# Altium schematic sheet Main.SchDoc
size A4
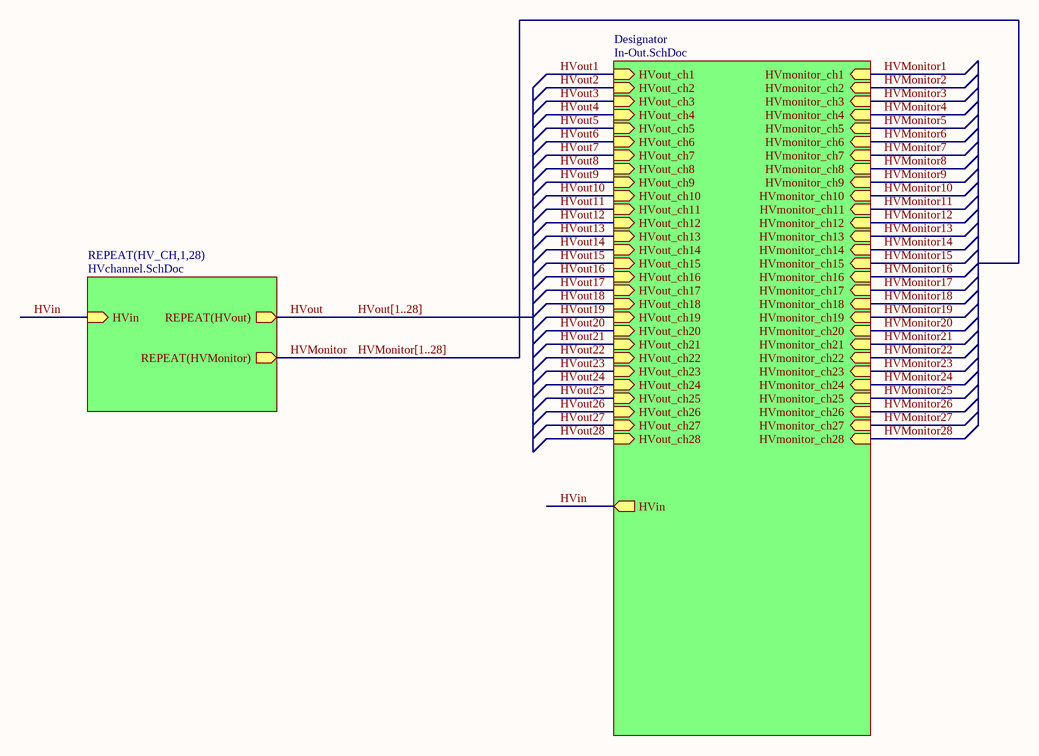
[diagram p0: Main.SchDoc]

## Sub-sheets
Designator = In-Out.SchDoc: HVout_ch1 (in), HVout_ch2 (in), HVout_ch3 (in), HVout_ch4 (in), HVout_ch5 (in), HVout_ch6 (in), HVout_ch7 (in), HVout_ch8 (in), HVout_ch9 (in), HVout_ch10 (in), HVout_ch11 (in), HVout_ch12 (in), HVout_ch13 (in), HVout_ch14 (in), HVout_ch15 (in), HVout_ch16 (in), HVout_ch17 (in), HVout_ch18 (in), HVout_ch19 (in), HVout_ch20 (in), HVout_ch21 (in), HVout_ch22 (in), HVout_ch23 (in), HVout_ch24 (in), HVout_ch25 (in), HVout_ch26 (in), HVout_ch27 (in), HVout_ch28 (in), HVmonitor_ch1 (in), HVmonitor_ch2 (in), HVmonitor_ch3 (in), HVmonitor_ch4 (in), HVmonitor_ch5 (in), HVmonitor_ch6 (in), HVmonitor_ch7 (in), HVmonitor_ch8 (in), HVmonitor_ch9 (in), HVmonitor_ch10 (in), HVmonitor_ch11 (in), HVmonitor_ch12 (in), HVmonitor_ch13 (in), HVmonitor_ch14 (in), HVmonitor_ch15 (in), HVmonitor_ch16 (in), HVmonitor_ch17 (in), HVmonitor_ch18 (in), HVmonitor_ch19 (in), HVmonitor_ch20 (in), HVmonitor_ch21 (in), HVmonitor_ch22 (in), HVmonitor_ch23 (in), HVmonitor_ch24 (in), HVmonitor_ch25 (in), HVmonitor_ch26 (in), HVmonitor_ch27 (in), HVmonitor_ch28 (in), HVin (out)
REPEAT(HV_CH,1,28) = HVchannel.SchDoc: HVin (in), REPEAT(HVout) (out), REPEAT(HVMonitor) (out)

## Nets
HVin: sheet Designator/HVin, sheet REPEAT(HV_CH,1,28)/HVin
HVMonitor: sheet REPEAT(HV_CH,1,28)/REPEAT(HVMonitor)
HVMonitor1: sheet Designator/HVmonitor_ch1
HVMonitor2: sheet Designator/HVmonitor_ch2
HVMonitor3: sheet Designator/HVmonitor_ch3
HVMonitor4: sheet Designator/HVmonitor_ch4
HVMonitor5: sheet Designator/HVmonitor_ch5
HVMonitor6: sheet Designator/HVmonitor_ch6
HVMonitor7: sheet Designator/HVmonitor_ch7
HVMonitor8: sheet Designator/HVmonitor_ch8
HVMonitor9: sheet Designator/HVmonitor_ch9
HVMonitor10: sheet Designator/HVmonitor_ch10
HVMonitor11: sheet Designator/HVmonitor_ch11
HVMonitor12: sheet Designator/HVmonitor_ch12
HVMonitor13: sheet Designator/HVmonitor_ch13
HVMonitor14: sheet Designator/HVmonitor_ch14
HVMonitor15: sheet Designator/HVmonitor_ch15
HVMonitor16: sheet Designator/HVmonitor_ch16
HVMonitor17: sheet Designator/HVmonitor_ch17
HVMonitor18: sheet Designator/HVmonitor_ch18
HVMonitor19: sheet Designator/HVmonitor_ch19
HVMonitor20: sheet Designator/HVmonitor_ch20
HVMonitor21: sheet Designator/HVmonitor_ch21
HVMonitor22: sheet Designator/HVmonitor_ch22
HVMonitor23: sheet Designator/HVmonitor_ch23
HVMonitor24: sheet Designator/HVmonitor_ch24
HVMonitor25: sheet Designator/HVmonitor_ch25
HVMonitor26: sheet Designator/HVmonitor_ch26
HVMonitor27: sheet Designator/HVmonitor_ch27
HVMonitor28: sheet Designator/HVmonitor_ch28
HVout: sheet REPEAT(HV_CH,1,28)/REPEAT(HVout)
HVout1: sheet Designator/HVout_ch1
HVout2: sheet Designator/HVout_ch2
HVout3: sheet Designator/HVout_ch3
HVout4: sheet Designator/HVout_ch4
HVout5: sheet Designator/HVout_ch5
HVout6: sheet Designator/HVout_ch6
HVout7: sheet Designator/HVout_ch7
HVout8: sheet Designator/HVout_ch8
HVout9: sheet Designator/HVout_ch9
HVout10: sheet Designator/HVout_ch10
HVout11: sheet Designator/HVout_ch11
HVout12: sheet Designator/HVout_ch12
HVout13: sheet Designator/HVout_ch13
HVout14: sheet Designator/HVout_ch14
HVout15: sheet Designator/HVout_ch15
HVout16: sheet Designator/HVout_ch16
HVout17: sheet Designator/HVout_ch17
HVout18: sheet Designator/HVout_ch18
HVout19: sheet Designator/HVout_ch19
HVout20: sheet Designator/HVout_ch20
HVout21: sheet Designator/HVout_ch21
HVout22: sheet Designator/HVout_ch22
HVout23: sheet Designator/HVout_ch23
HVout24: sheet Designator/HVout_ch24
HVout25: sheet Designator/HVout_ch25
HVout26: sheet Designator/HVout_ch26
HVout27: sheet Designator/HVout_ch27
HVout28: sheet Designator/HVout_ch28

## Buses and harness runs
bus HVMonitor[1..28]
bus HVout[1..28]